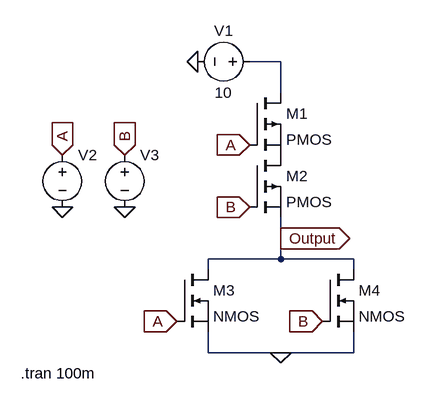
[diagram p0: schematic cmos_nor.asc]
cmos_nor.asc, the LTspice schematic file:
Version 4.1
SHEET 1 880 680
WIRE 208 0 160 0
WIRE 208 48 208 0
WIRE 208 272 208 240
WIRE 208 304 208 272
WIRE 208 304 96 304
WIRE 320 304 208 304
WIRE 96 320 96 304
WIRE 320 320 320 304
WIRE 96 448 96 416
WIRE 208 448 96 448
WIRE 320 448 320 416
WIRE 320 448 208 448
FLAG 208 448 0
FLAG 80 0 0
FLAG -128 224 0
FLAG -32 224 0
FLAG -128 144 A
IOPIN -128 144 In
FLAG 160 128 A
IOPIN 160 128 In
FLAG 48 400 A
IOPIN 48 400 In
FLAG -32 144 B
IOPIN -32 144 In
FLAG 160 224 B
IOPIN 160 224 In
FLAG 272 400 B
IOPIN 272 400 In
FLAG 208 272 Output
IOPIN 208 272 Out
SYMBOL pmos 160 48 R0
SYMATTR InstName M1
SYMBOL pmos 160 144 R0
SYMATTR InstName M2
SYMBOL nmos 48 320 R0
SYMATTR InstName M3
SYMBOL nmos 272 320 R0
SYMATTR InstName M4
SYMBOL voltage 176 0 R90
WINDOW 0 -32 56 VBottom 2
WINDOW 3 32 56 VTop 2
WINDOW 123 0 0 Left 0
WINDOW 39 0 0 Left 0
SYMATTR InstName V1
SYMATTR Value 10
SYMBOL voltage -128 128 R0
WINDOW 3 24 96 Invisible 2
WINDOW 123 0 0 Left 0
WINDOW 39 0 0 Left 0
SYMATTR InstName V2
SYMATTR Value PULSE(0 10 0 1n 1n 10m 20m)
SYMBOL voltage -32 128 R0
WINDOW 3 24 96 Invisible 2
WINDOW 123 0 0 Left 0
WINDOW 39 0 0 Left 0
SYMATTR InstName V3
SYMATTR Value PULSE(0 10 0 1n 1n 20m 40m)
TEXT -192 480 Left 2 !.tran 100m

The netlist it stands for:
* cmos_nor.asc
M1 N001 A P001 P001 PMOS
M2 P001 B Output Output PMOS
M3 Output A 0 0 NMOS
M4 Output B 0 0 NMOS
V1 N001 0 10
V2 A 0 PULSE(0 10 0 1n 1n 10m 20m)
V3 B 0 PULSE(0 10 0 1n 1n 20m 40m)
.model NMOS NMOS
.model PMOS PMOS
.lib standard.mos
.tran 100m
.backanno
.end